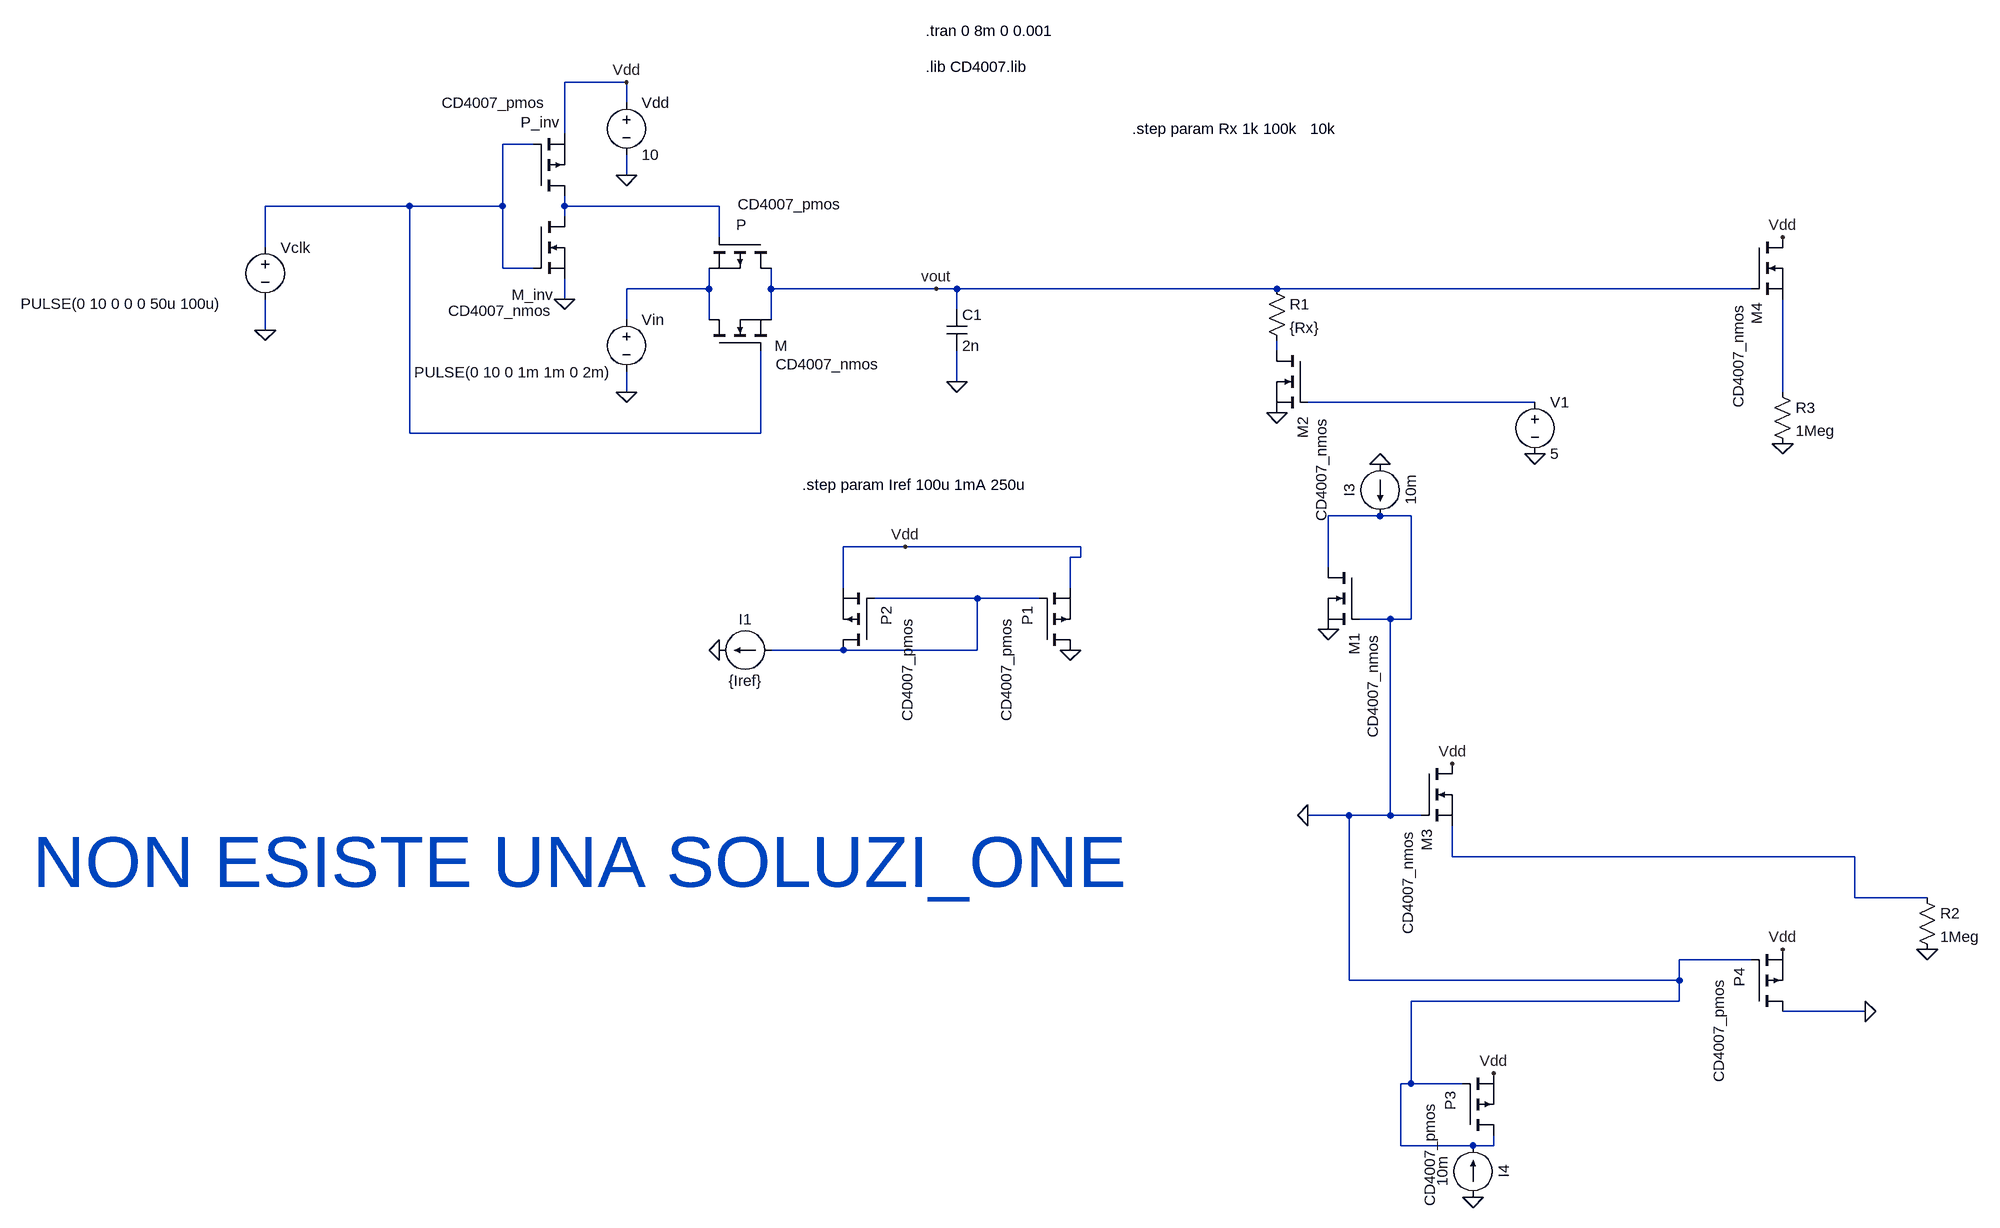
[diagram p0: schematic SampleAndHold_TrasmissionGate.asc]
SampleAndHold_TrasmissionGate.asc, the LTspice schematic file:
Version 4.1
SHEET 1 2072 1588
WIRE -32 -160 -128 -160
WIRE -32 -128 -32 -160
WIRE -128 -80 -128 -160
WIRE -176 -64 -224 -64
WIRE -32 -16 -32 -48
WIRE -368 32 -592 32
WIRE -224 32 -224 -64
WIRE -224 32 -368 32
WIRE -128 32 -128 16
WIRE 112 32 -128 32
WIRE -128 48 -128 32
WIRE 112 80 112 32
WIRE -592 96 -592 32
WIRE -224 128 -224 32
WIRE -176 128 -224 128
WIRE 96 160 96 128
WIRE 96 160 -32 160
WIRE 192 160 192 128
WIRE 448 160 192 160
WIRE 480 160 448 160
WIRE 976 160 480 160
WIRE 1712 160 976 160
WIRE -128 176 -128 144
WIRE 480 192 480 160
WIRE -32 208 -32 160
WIRE 96 208 96 160
WIRE 192 208 192 160
WIRE -592 224 -592 176
WIRE 976 256 976 240
WIRE 480 304 480 256
WIRE -32 320 -32 288
WIRE 1760 320 1760 176
WIRE 1376 336 1024 336
WIRE -368 384 -368 32
WIRE 176 384 176 256
WIRE 176 384 -368 384
WIRE 1136 512 1056 512
WIRE 1184 512 1136 512
WIRE 400 560 304 560
WIRE 672 560 400 560
WIRE 672 576 672 560
WIRE 672 576 656 576
WIRE 1056 592 1056 512
WIRE 304 624 304 560
WIRE 656 624 656 576
WIRE 512 640 352 640
WIRE 608 640 512 640
WIRE 1152 672 1104 672
WIRE 1184 672 1184 512
WIRE 1184 672 1152 672
WIRE 304 720 192 720
WIRE 512 720 512 640
WIRE 512 720 304 720
WIRE 1088 976 1024 976
WIRE 1152 976 1152 672
WIRE 1152 976 1088 976
WIRE 1200 976 1152 976
WIRE 1248 1040 1248 992
WIRE 1872 1040 1248 1040
WIRE 1872 1104 1872 1040
WIRE 1984 1104 1872 1104
WIRE 1712 1200 1600 1200
WIRE 1088 1232 1088 976
WIRE 1600 1232 1600 1200
WIRE 1600 1232 1088 1232
WIRE 1600 1264 1600 1232
WIRE 1600 1264 1184 1264
WIRE 1888 1280 1760 1280
WIRE 1184 1392 1184 1264
WIRE 1184 1392 1168 1392
WIRE 1264 1392 1184 1392
WIRE 1168 1488 1168 1392
WIRE 1280 1488 1168 1488
WIRE 1312 1488 1312 1472
WIRE 1312 1488 1280 1488
FLAG -32 320 0
FLAG -128 176 0
FLAG -592 224 0
FLAG -32 -16 0
FLAG -32 -160 Vdd
FLAG 400 560 Vdd
FLAG 112 720 0
FLAG 448 160 vout
FLAG 1056 688 0
FLAG 1248 896 Vdd
FLAG 656 720 0
FLAG 1136 432 0
FLAG 480 304 0
FLAG 1312 1376 Vdd
FLAG 1280 1568 0
FLAG 1760 1184 Vdd
FLAG 1984 1184 0
FLAG 1024 976 0
FLAG 976 352 0
FLAG 1376 416 0
FLAG 1888 1280 0
FLAG 1760 80 Vdd
FLAG 1760 400 0
SYMBOL nmos 96 256 R270
WINDOW 0 8 102 VRight 2
WINDOW 3 -21 103 VRight 2
SYMATTR InstName M
SYMATTR Value CD4007_nmos
SYMBOL pmos 192 80 R90
WINDOW 0 -19 38 VRight 2
WINDOW 3 -51 -110 VRight 2
SYMATTR InstName P
SYMATTR Value CD4007_pmos
SYMBOL pmos -176 16 M180
WINDOW 0 -20 114 Left 2
WINDOW 3 -142 144 Left 2
SYMATTR InstName P_inv
SYMATTR Value CD4007_pmos
SYMBOL nmos -176 48 R0
WINDOW 0 31 121 Right 2
WINDOW 3 29 146 Right 2
SYMATTR InstName M_inv
SYMATTR Value CD4007_nmos
SYMBOL voltage -32 192 R0
WINDOW 3 -329 97 Left 2
WINDOW 123 0 0 Left 0
WINDOW 39 0 0 Left 0
SYMATTR Value PULSE(0 10 0 1m 1m 0 2m)
SYMATTR InstName Vin
SYMBOL voltage -592 80 R0
WINDOW 3 -379 103 Left 2
WINDOW 123 0 0 Left 0
WINDOW 39 0 0 Left 0
SYMATTR Value PULSE(0 10 0 0 0 50u 100u)
SYMATTR InstName Vclk
SYMBOL voltage -32 -144 R0
WINDOW 123 0 0 Left 0
WINDOW 39 0 0 Left 0
SYMATTR InstName Vdd
SYMATTR Value 10
SYMBOL pmos 608 720 M180
WINDOW 0 -19 38 VRight 2
WINDOW 3 -51 -110 VRight 2
SYMATTR InstName P1
SYMATTR Value CD4007_pmos
SYMBOL pmos 352 720 R180
WINDOW 0 -19 38 VRight 2
WINDOW 3 -51 -110 VRight 2
SYMATTR InstName P2
SYMATTR Value CD4007_pmos
SYMBOL current 192 720 R90
WINDOW 0 -32 40 VBottom 2
WINDOW 3 32 40 VTop 2
WINDOW 123 0 0 Left 0
WINDOW 39 0 0 Left 0
SYMATTR InstName I1
SYMATTR Value {Iref}
SYMBOL nmos 1104 592 M0
WINDOW 0 8 102 VRight 2
WINDOW 3 -21 103 VRight 2
SYMATTR InstName M1
SYMATTR Value CD4007_nmos
SYMBOL nmos 1200 896 R0
WINDOW 0 8 102 VRight 2
WINDOW 3 -21 103 VRight 2
SYMATTR InstName M3
SYMATTR Value CD4007_nmos
SYMBOL current 1136 432 R0
WINDOW 0 -32 40 VBottom 2
WINDOW 3 32 40 VTop 2
WINDOW 123 0 0 Left 0
WINDOW 39 0 0 Left 0
SYMATTR InstName I3
SYMATTR Value 10m
SYMBOL cap 464 192 R0
SYMATTR InstName C1
SYMATTR Value 2n
SYMBOL pmos 1264 1472 M180
WINDOW 0 -19 38 VRight 2
WINDOW 3 -51 -110 VRight 2
SYMATTR InstName P3
SYMATTR Value CD4007_pmos
SYMBOL pmos 1712 1280 M180
WINDOW 0 -19 38 VRight 2
WINDOW 3 -51 -110 VRight 2
SYMATTR InstName P4
SYMATTR Value CD4007_pmos
SYMBOL res 1968 1088 R0
SYMATTR InstName R2
SYMATTR Value 1Meg
SYMBOL current 1280 1568 R180
WINDOW 0 -32 40 VBottom 2
WINDOW 3 32 40 VTop 2
WINDOW 123 0 0 Left 0
WINDOW 39 0 0 Left 0
SYMATTR InstName I4
SYMATTR Value 10m
SYMBOL nmos 1024 256 M0
WINDOW 0 8 102 VRight 2
WINDOW 3 -21 103 VRight 2
SYMATTR InstName M2
SYMATTR Value CD4007_nmos
SYMBOL voltage 1376 320 R0
WINDOW 123 0 0 Left 0
WINDOW 39 0 0 Left 0
SYMATTR InstName V1
SYMATTR Value 5
SYMBOL res 960 144 R0
SYMATTR InstName R1
SYMATTR Value {Rx}
SYMBOL nmos 1712 80 R0
WINDOW 0 8 102 VRight 2
WINDOW 3 -21 103 VRight 2
SYMATTR InstName M4
SYMATTR Value CD4007_nmos
SYMBOL res 1744 304 R0
SYMATTR InstName R3
SYMATTR Value 1Meg
TEXT 432 -184 Left 2 !.lib CD4007.lib
TEXT 432 -240 Left 2 !.tran 0 8m 0 0.001
TEXT 240 464 Left 2 !.step param Iref 100u 1mA 250u
TEXT 752 -88 Left 2 !.step param Rx 1k 100k   10k
TEXT -952 1048 Left 7 ;NON ESISTE UNA SOLUZI_ONE

The netlist it stands for:
* SampleAndHold_TrasmissionGate.asc
M N003 N001 vout vout CD4007_nmos
M§P vout N002 N003 N003 CD4007_pmos
M§P_inv N002 N001 Vdd Vdd CD4007_pmos
M_inv N002 N001 0 0 CD4007_nmos
Vin N003 0 PULSE(0 10 0 1m 1m 0 2m)
Vclk N001 0 PULSE(0 10 0 0 0 50u 100u)
Vdd Vdd 0 10
M§P1 0 N007 Vdd Vdd CD4007_pmos
M§P2 N007 N007 Vdd Vdd CD4007_pmos
I1 N007 0 {Iref}
M1 0 0 0 0 CD4007_nmos
M3 Vdd 0 N008 N008 CD4007_nmos
I3 0 0 10m
C1 vout 0 2n
M§P3 0 0 Vdd Vdd CD4007_pmos
M§P4 0 0 Vdd Vdd CD4007_pmos
R2 N008 0 1Meg
I4 0 0 10m
M2 N004 N006 0 0 CD4007_nmos
V1 N006 0 5
R1 vout N004 {Rx}
M4 Vdd vout N005 N005 CD4007_nmos
R3 N005 0 1Meg
.model NMOS NMOS
.model PMOS PMOS
.lib standard.mos
.lib CD4007.lib
.tran 0 8m 0 0.001
.step param Iref 100u 1mA 250u
.step param Rx 1k 100k   10k
* NON ESISTE UNA SOLUZI_ONE
.backanno
.end